# EAGLE design dataloggerver4.1 (EAGLE 9.6.2)
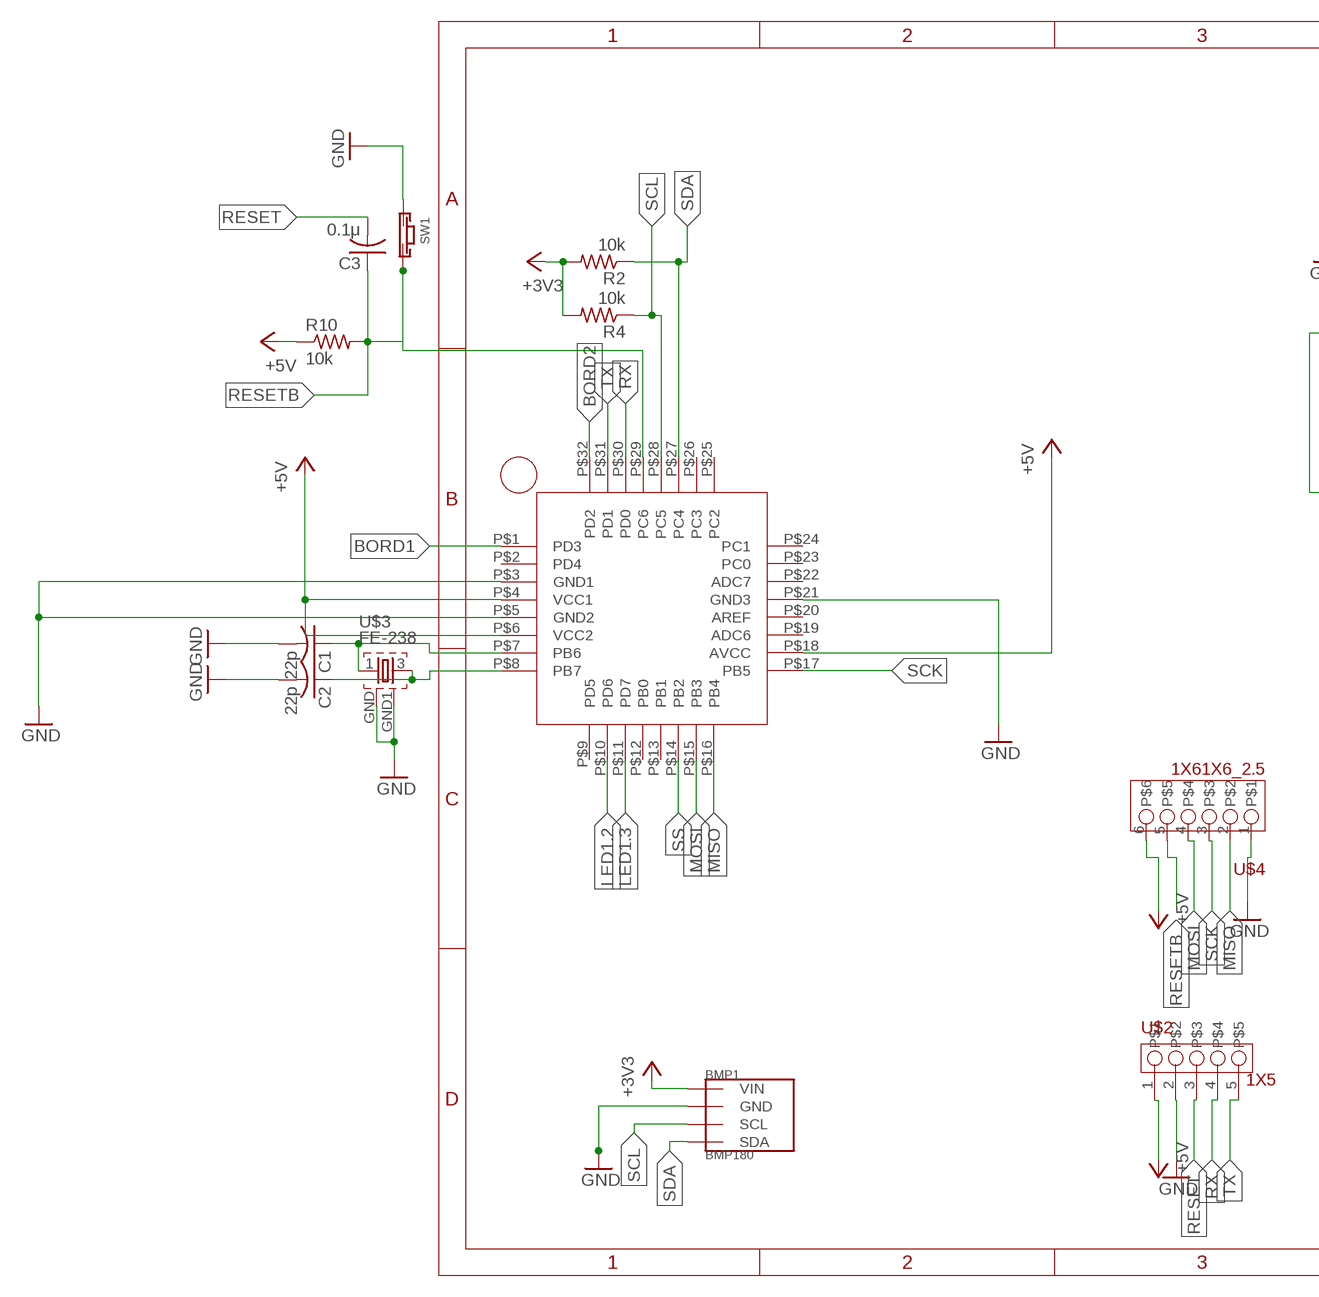
[diagram p0: schematic, sheet 1, part 1 of 2]
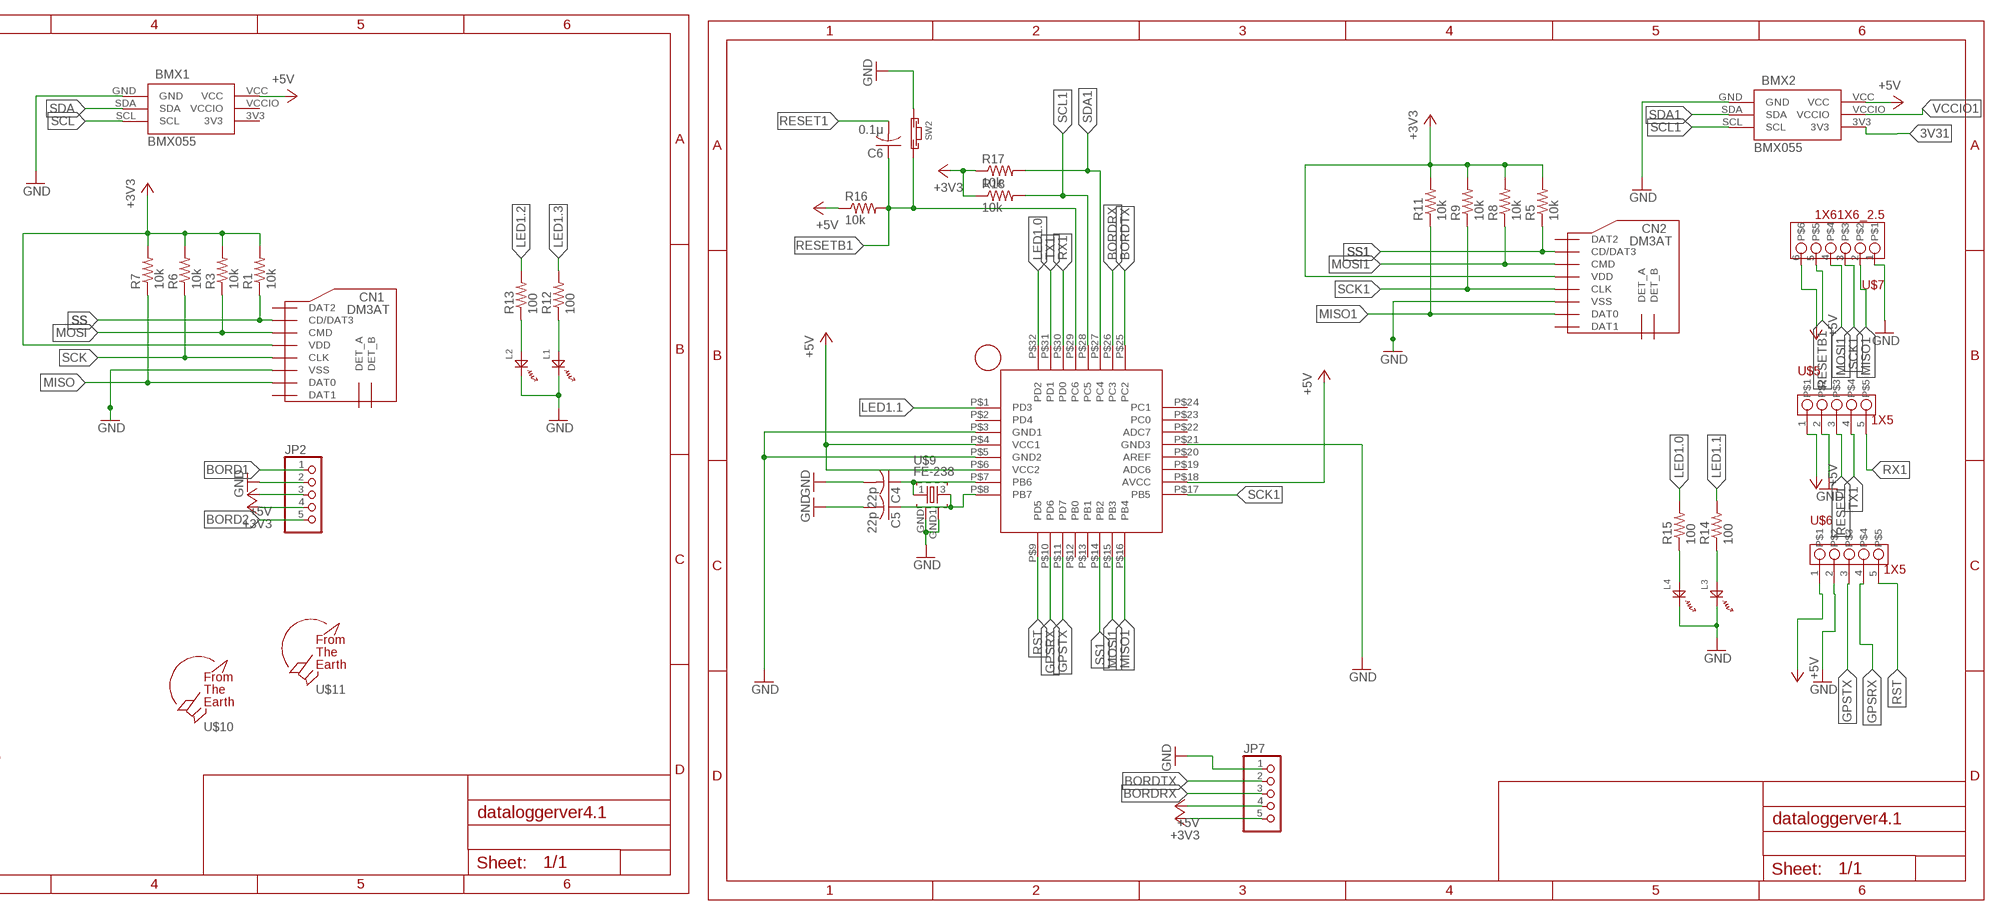
[diagram p1: schematic, sheet 1, part 2 of 2]

## Parts
BMP1  BMP180  [GY-68]
BMX1  BMX055  [BMX055]
BMX2  BMX055  [BMX055]
C1  22p  C-USC1608  [C1608]
C2  22p  C-USC1608  [C1608]
C3  0.1μ  C-USC1608  [C1608]
C4  22p  C-USC1608  [C1608]
C5  22p  C-USC1608  [C1608]
C6  0.1μ  C-USC1608  [C1608]
CN1  DM3AT  [DM3AT]
CN2  DM3AT  [DM3AT]
JP2  PINHD-1X5  [1X05]
JP7  PINHD-1X5  [1X05]
L1  OSXX1608C1A  [OSXX1608C1A]
L2  OSXX1608C1A  [OSXX1608C1A]
L3  OSXX1608C1A  [OSXX1608C1A]
L4  OSXX1608C1A  [OSXX1608C1A]
R1  10k  R-US_R0603  [R0603]
R2  10k  R-US_R0603  [R0603]
R3  10k  R-US_R0603  [R0603]
R4  10k  R-US_R0603  [R0603]
R5  10k  R-US_R0603  [R0603]
R6  10k  R-US_R0603  [R0603]
R7  10k  R-US_R0603  [R0603]
R8  10k  R-US_R0603  [R0603]
R9  10k  R-US_R0603  [R0603]
R10  10k  R-US_R0603  [R0603]
R11  10k  R-US_R0603  [R0603]
R12  100  R-US_R0603  [R0603]
R13  100  R-US_R0603  [R0603]
R14  100  R-US_R0603  [R0603]
R15  100  R-US_R0603  [R0603]
R16  10k  R-US_R0603  [R0603]
R17  10k  R-US_R0603  [R0603]
R18  10k  R-US_R0603  [R0603]
SW1  TVAF06-A020B-R  [TVAF06-A020B-R]
SW2  TVAF06-A020B-R  [TVAF06-A020B-R]
U$1  ATMEGA328P-AUATMEGA328P-AU  [ATMEGA328P-AU]
U$2  1X5  [HDRVR5W64P254_1X5_1310X250X865B]
U$3  FE-238  [OSCCC300X230X120N]
U$4  1X61X6_2.5  [HDRVR6W64P254_1X6_1564X250X865B]
U$5  1X5  [HDRVR5W64P254_1X5_1310X250X865B]
U$6  1X5  [HDRVR5W64P254_1X5_1310X250X865B]
U$7  1X61X6_2.5  [HDRVR6W64P254_1X6_1564X250X865B]
U$8  ATMEGA328P-AUATMEGA328P-AU  [ATMEGA328P-AU]
U$9  FE-238  [OSCCC300X230X120N]
U$10  F.T.E.LOGO  [LOGO]
U$11  F.T.E.LOGO  [LOGO]

## Nets
3V31: BMX2.3V3
+3V3: BMP1.P1(VIN) CN1.VDD CN2.VDD JP2.4 JP7.5 R1.2 R2.2 R3.2 R4.2 R5.2 R6.2 R7.2 R8.2 R9.2 R11.2 R17.1 R18.1
+5V: BMX1.VCC BMX2.VCC JP2.3 JP7.4 R10.1 R16.1 U$1.P$4(VCC1) U$1.P$6(VCC2) U$1.P$18(AVCC) U$2.1 U$4.6 U$5.1 U$6.1 U$7.6 U$8.P$4(VCC1) U$8.P$6(VCC2) U$8.P$18(AVCC)
BORD1: JP2.1 U$8.P$1(PD3)
BORD2: JP2.5 U$8.P$32(PD2)
BORDRX: JP7.3 U$1.P$26(PC3)
BORDTX: JP7.2 U$1.P$25(PC2)
GND: BMP1.P2(GND) BMX1.GND BMX2.GND C1.2 C2.2 C4.2 C5.2 CN1.VSS CN2.VSS JP2.2 JP7.1 L1.CT L2.CT L3.CT L4.CT SW1.P$1 SW2.P$1 U$1.P$3(GND1) U$1.P$5(GND2) U$1.P$21(GND3) U$2.2 U$3.GND U$3.GND1 U$4.1 U$5.2 U$6.2 U$7.1 U$8.P$3(GND1) U$8.P$5(GND2) U$8.P$21(GND3) U$9.GND U$9.GND1
GPSRX: U$1.P$10(PD6) U$6.4
GPSTX: U$1.P$11(PD7) U$6.3
LED1.0: R15.2 U$1.P$32(PD2)
LED1.1: R14.2 U$1.P$1(PD3)
LED1.2: R13.2 U$8.P$10(PD6)
LED1.3: R12.2 U$8.P$11(PD7)
MISO: CN1.DAT0 R7.1 U$4.2 U$8.P$16(PB4)
MISO1: CN2.DAT0 R11.1 U$1.P$16(PB4) U$7.2
MOSI: CN1.CMD R3.1 U$4.4 U$8.P$15(PB3)
MOSI1: CN2.CMD R8.1 U$1.P$15(PB3) U$7.4
N$1: L2.AN R13.1
N$2: L4.AN R15.1
N$3: C4.1 U$1.P$7(PB6) U$9.1
N$7: L1.AN R12.1
N$11: L3.AN R14.1
N$14: C5.1 U$1.P$8(PB7) U$9.3
N$16: C1.1 U$3.1 U$8.P$7(PB6)
N$17: C2.1 U$3.3 U$8.P$8(PB7)
RESET: C3.2 U$2.3
RESET1: C6.2 U$5.3
RESETB: C3.1 R10.2 SW1.P$2 U$4.5 U$8.P$29(PC6)
RESETB1: C6.1 R16.2 SW2.P$2 U$1.P$29(PC6) U$7.5
RST: U$1.P$9(PD5) U$6.5
RX: U$2.4 U$8.P$30(PD0)
RX1: U$1.P$30(PD0) U$5.5
SCK: CN1.CLK R6.1 U$4.3 U$8.P$17(PB5)
SCK1: CN2.CLK R9.1 U$1.P$17(PB5) U$7.3
SCL: BMP1.P3(SCL) BMX1.SCL R4.1 U$8.P$28(PC5)
SCL1: BMX2.SCL R18.2 U$1.P$28(PC5)
SDA: BMP1.P4(SDA) BMX1.SDA R2.1 U$8.P$27(PC4)
SDA1: BMX2.SDA R17.2 U$1.P$27(PC4)
SS: CN1.CD/DAT3 R1.1 U$8.P$14(PB2)
SS1: CN2.CD/DAT3 R5.1 U$1.P$14(PB2)
TX: U$2.5 U$8.P$31(PD1)
TX1: U$1.P$31(PD1) U$5.4
VCCIO1: BMX2.VCCIO
Unconnected: CN1.DAT1 CN1.DAT2 CN1.DET_A CN1.DET_B CN2.DAT1 CN2.DAT2 CN2.DET_A CN2.DET_B U$1.P$2(PD4) U$1.P$12(PB0) U$1.P$13(PB1) U$1.P$19(ADC6) U$1.P$20(AREF) U$1.P$22(ADC7) U$1.P$23(PC0) U$1.P$24(PC1) U$8.P$2(PD4) U$8.P$9(PD5) U$8.P$12(PB0) U$8.P$13(PB1) U$8.P$19(ADC6) U$8.P$20(AREF) U$8.P$22(ADC7) U$8.P$23(PC0) U$8.P$24(PC1) U$8.P$25(PC2) U$8.P$26(PC3)

## Power pins joined to a net without a drawn wire
3V3: BMX1.3V3
VCCIO: BMX1.VCCIO

## Library data of the parts
BMP1 = BMP180:BMP180
BMX1 BMX2 = BMX055:BMX055
C1-C6 = rcl:C-US: CAPACITOR, American symbol; SPICEPREFIX: C
CN1 CN2 = microSD:DM3AT
JP2 JP7 = pinhead:PINHD-1X5: PIN HEADER
L1-L4 = Chip LED:OSXX1608C1A
R1-R18 = rcl:R-US_: RESISTOR, American symbol; SPICEPREFIX: R
SW1 SW2 = Tact switch:TVAF06-A020B-R
U$1 U$8 = ATMEGA328P-AU:ATMEGA328P-AU
U$2 U$5 U$6 = pin_socket:1X5
U$3 U$9 = FA-238:FE-238
U$4 U$7 = pin_socket:1X6
U$10 U$11 = logo:F.T.E.LOGO

## Board
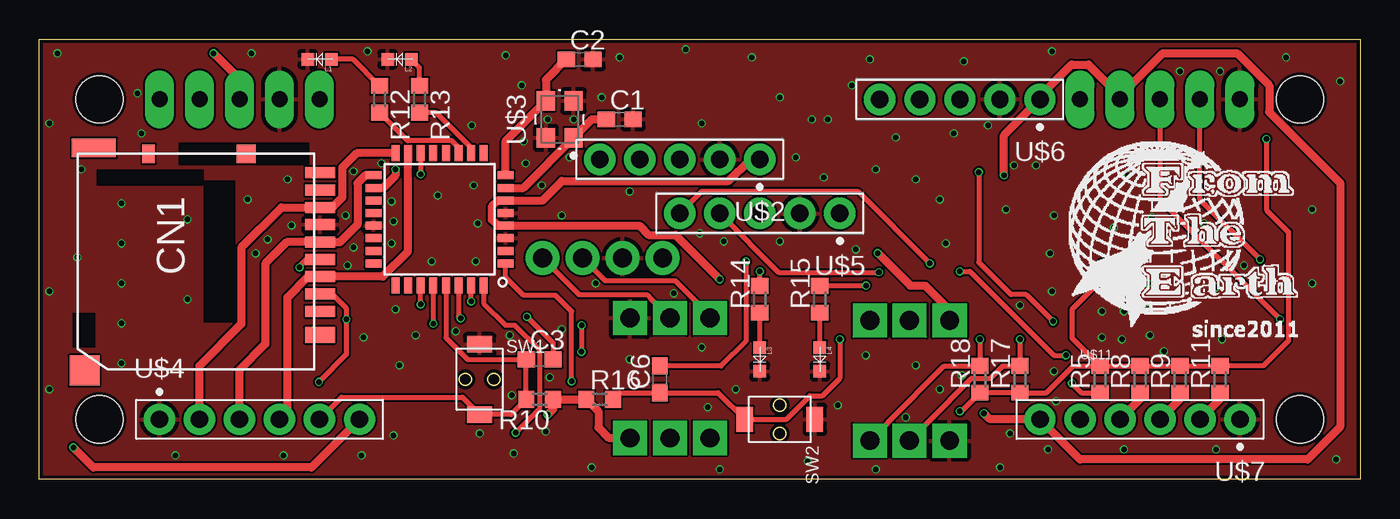
[diagram p2: board, top side]
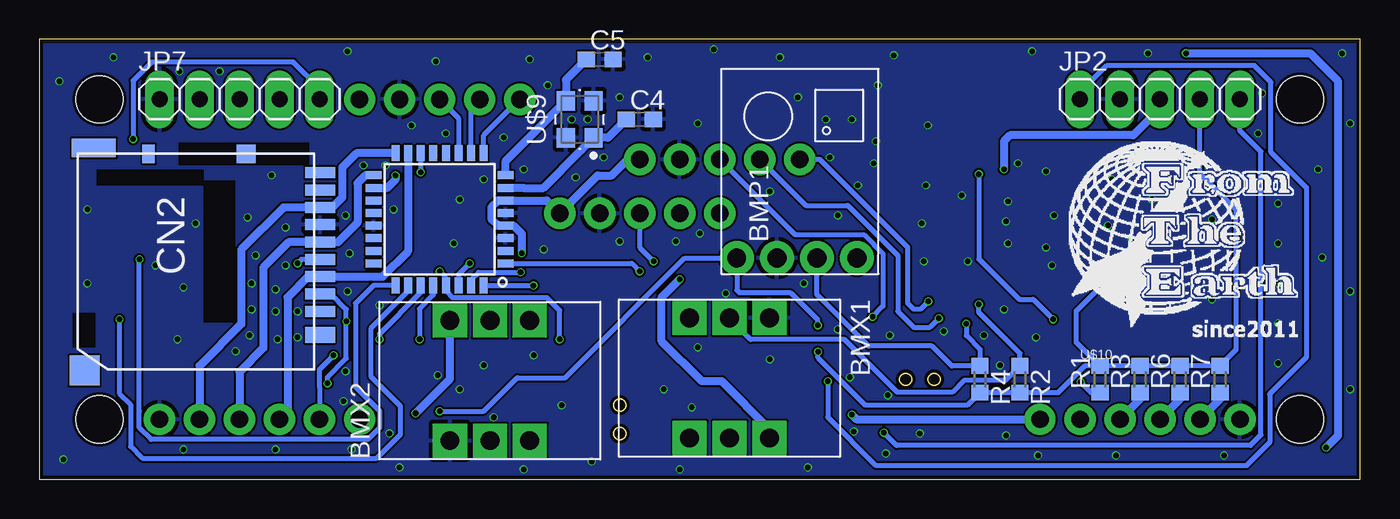
[diagram p3: board, bottom side, seen from below]

Size 83.82 x 27.94 mm. Coordinates in mm from the lower left corner, seen from the top.
Outline: 0,0 0,27.94 83.82,27.94 83.82,0 0,0
Copper layers (1*16): Top 0.035mm / dielectric 1.6mm / Bottom 0.035mm
Design rules "jlcpcb-2layers": minimum track width 5mil, minimum drill 0.3mm, track to track 5mil, track to pad 5mil, pad to pad 5mil, via to via 5mil, smd to smd 5mil, copper to edge 0.2mm, drill to drill 6mil, minimum pad ring 10mil, minimum via ring 3mil, stop-mask expansion 4mil, vias tented up to drill 0mil, thermal gap 10mil
Holes 3 mm at 3.81,24.13 3.81,3.81 80.01,24.13 80.01,3.81

### Footprints (pad centres in the part's own frame; a part is rotated, then mirrored left to right if it is on the bottom)
GY-68 = drill 1.2: P1 -5,4; P2 -5,1.46; P3 -5,-1.08; P4 -5,-3.62
BMX055 = drill 1.2 pad 1.5 square: 3V3 8.81,-9.53; GND 1.19,-4.46; SCL 1.19,-9.53; SDA 1.19,-7; VCC 8.81,-4.46; VCCIO 8.81,-7
C1608 = smd 1.1 x 1: 1 -0.85,0; 2 0.85,0
DM3AT = smd 0.7 x 1.9: CD/DAT3 2.2,6.4; CLK -1.1,6.4; CMD 1.1,6.4; DAT0 -3.3,6.4; DAT1 -4.4,6.4; DAT2 3.3,6.4; DET_B -5.5,6.4; VDD 0,6.4; VSS -2.2,6.4 | smd 1.2 x 0.8: DET_A -6.7,-4.5 | smd 1 x 1.9: P$9 4.8,6.381 | smd 1.2 x 1.2: P$11 -6.7,1.7 | smd 1.2 x 2.8: P$13 -7.081,-7.973 | smd 1.9 x 1.9: P$14 7.054,-8.562
1X05 = drill 1.016 long: 1 -5.08,0; 2 -2.54,0; 3 0,0; 4 2.54,0; 5 5.08,0
OSXX1608C1A = smd 0.8 x 0.8: AN -0.75,0; CT 0.75,0
R0603 = smd 1 x 1.1: 1 -0.85,0; 2 0.85,0
TVAF06-A020B-R = smd 1.6 x 1.05: P$1 0,2.225; P$2 0,-2.225
ATMEGA328P-AU = smd 1.016 x 0.508: P$1 -4.2,2.8; P$2 -4.2,2; P$3 -4.2,1.2; P$4 -4.2,0.4; P$5 -4.2,-0.4; P$6 -4.2,-1.2; P$7 -4.2,-2; P$8 -4.2,-2.8; P$17 4.2,-2.8; P$18 4.2,-2; P$19 4.2,-1.2; P$20 4.2,-0.4; P$21 4.2,0.4; P$22 4.2,1.2; P$23 4.2,2; P$24 4.2,2.8 | smd 0.508 x 1.016: P$9 -2.8,-4.2; P$10 -2,-4.2; P$11 -1.2,-4.2; P$12 -0.4,-4.2; P$13 0.4,-4.2; P$14 1.2,-4.2; P$15 2,-4.2; P$16 2.8,-4.2; P$25 2.8,4.2; P$26 2,4.2; P$27 1.2,4.2; P$28 0.4,4.2; P$29 -0.4,4.2; P$30 -1.2,4.2; P$31 -2,4.2; P$32 -2.8,4.2
HDRVR5W64P254_1X5_1310X250X865B = drill 1.105 pad 1.705: 1 0,0; 2 2.54,0; 3 5.08,0; 4 7.62,0; 5 10.16,0
OSCCC300X230X120N = smd 1.262 x 1.162: 1 -1.175,-0.875; 3 1.175,0.875; GND 1.175,-0.875; GND1 -1.175,0.875
HDRVR6W64P254_1X6_1564X250X865B = drill 1.105 pad 1.705: 1 0,0; 2 2.54,0; 3 5.08,0; 4 7.62,0; 5 10.16,0; 6 12.7,0

### Placement (x,y rotation side)
BMP1  35.56,19.05 90 bottom
BMX1  33.02,11.43 270 bottom
BMX2  62.23,1.27 90 bottom
C1  36.83,22.86 0 top
C2  34.29,26.67 0 top
C3  31.75,7.62 0 top
C4  45.72,22.86 0 bottom
C5  48.26,26.67 0 bottom
C6  39.37,6.35 90 top
CN1  11.43,13.97 270 top
CN2  72.39,13.97 270 bottom
JP2  12.7,24.13 0 bottom
JP7  71.12,24.13 0 bottom
L1  17.78,26.67 180 top
L2  22.86,26.67 180 top
L3  45.72,7.62 270 top
L4  49.53,7.62 270 top
R1  16.51,6.35 90 bottom
R2  21.59,6.35 270 bottom
R3  13.97,6.35 90 bottom
R4  24.13,6.35 270 bottom
R5  67.31,6.35 90 top
R6  11.43,6.35 90 bottom
R7  8.89,6.35 90 bottom
R8  69.85,6.35 90 top
R9  72.39,6.35 90 top
R10  31.75,5.08 180 top
R11  74.93,6.35 90 top
R12  21.59,24.13 270 top
R13  24.13,24.13 270 top
R14  45.72,11.43 90 top
R15  49.53,11.43 90 top
R16  35.56,5.08 0 top
R17  62.23,6.35 90 top
R18  59.69,6.35 90 top
SW1  27.94,6.35 0 top
SW2  46.99,3.81 270 top
U$1  58.42,16.51 180 bottom
U$2  45.72,20.32 180 top
U$3  33.02,22.86 90 top
U$4  7.62,3.81 0 top
U$5  50.8,16.89 180 top
U$6  63.5,24.13 180 top
U$7  76.2,3.81 180 top
U$8  25.4,16.51 180 top
U$9  49.53,22.86 90 bottom
U$10  19.05,7.62 0 bottom
U$11  64.77,7.62 0 top

### Tracks (layer width: path | path; a pad name or v marks a point on that pad's centre or on a via)
+3V3  (via drill 0.35)
  Top 0.305: R5.2 R8.2 R9.2 R11.2 74.95,7.22 77.69,7.22 79.27,8.8 79.27,15.71 77.87,17.12 v77.87,21.61 | R5.2 65.62,7.2 63.92,5.5 R17.1 R18.1 58.51,4.32 v58.42,4.32 | CN1.VDD 16.94,13.97 16.51,13.54 v16.51,13.46 | R5.2 65.53,8.98 65.53,10.79 67.44,12.7 v67.44,13.72 | v34.42,9.78 34.42,8.12 v34.41,8.11
  Bottom 0.305: R1.2 R3.2 R6.2 R7.2 7.87,8.22 7.87,17.14 10.16,19.43 JP2.4 | R1.2 17.47,7.2 19.17,5.5 R2.2 R4.2 24.93,4.7 31.38,4.7 34.41,7.72 v34.41,8.11 | v58.42,4.32 55.63,4.32 53.49,6.45 50.46,6.45 42.86,14.05 BMP1.P1 39.56,12.02 39.4,11.85 36.16,11.85 34.42,10.11 v34.42,9.78 | v16.51,13.46 16.51,12.19 18.03,10.67 18.03,8.72 R1.2 | JP7.5 66.04,24.83 67.7,26.49 76.69,26.49 77.87,25.32 v77.87,21.61 | CN2.VDD 67.18,13.97 v67.44,13.72
+5V  (via drill 0.35)
  Top 0.508: v22.61,19.68 22.61,19.3 21.81,18.51 U$8.P$18 | v32.26,4.1 v32.26,4.11 32.6,4.45 R10.1 R16.1 35.47,4.32 35.47,3.3 36.15,2.62 BMX1.VCC | U$2.1 45.12,20.32 43.75,18.94 33.17,18.94 31.93,17.71 U$8.P$6 29.1,17.71 28.71,17.32 28.71,16.5 29.1,16.11 U$8.P$4 38.08,16.11 38.67,15.51 40.37,15.51 v43.18,12.7 | v61.21,19.3 61.21,21.84 U$6.1 63.5,24.34 65.5,26.34 66.58,26.34 68.58,24.34 JP7.4 68.55,24.16 68.55,24.31 71.3,27.05 76.02,27.05 78.06,25.02 78.06,23.32 82.55,18.83 82.55,3.33 80.49,1.27 66.04,1.27 U$7.6 60.33,3.81 v59.94,4.19 | v2.16,2.03 3.43,0.76 17.27,0.76 U$4.6 | v11.05,27.05 12.7,25.4 JP2.3 | v53.2,14.37 55.27,12.3 56.21,12.3 57.77,10.75 BMX2.VCC
  Bottom 0.508: JP2.3 12.7,23.54 14.4,21.84 22.22,21.84 22.61,21.46 v22.61,19.68 | v32.26,4.1 31.97,3.81 U$4.6 | U$2.1 46.48,20.32 47.5,19.3 48.39,19.3 U$5.1 51.62,17.71 U$1.P$6 54.72,17.71 55.11,17.32 55.11,16.5 54.72,16.11 U$1.P$4 53.72,16.11 53.2,15.59 v53.2,14.37 | U$1.P$18 61.74,18.51 61.21,19.03 v61.21,19.3 | v2.16,2.03 1.4,2.79 1.4,25.27 3.17,27.05 v11.05,27.05 | BMX2.VCC 57.77,6.37 v59.94,4.19 | BMX1.VCC 37.48,3.19 40.51,6.22 41.78,6.22 44.32,8.76 44.32,11.56 v43.18,12.7
BORD1  (via drill 0.35)
  Top 0.305: U$8.P$1 29.6,12.82 30.74,11.68 32.77,11.68 33.78,10.67 v33.78,6.22
  Bottom 0.305: JP2.1 17.78,24.57 16.07,26.29 6.73,26.29 5.66,25.22 5.66,20.79 3.4,18.53 3.4,7.75 5.74,5.41 5.74,2.35 7.22,0.87 30.71,0.87 33.78,3.94 v33.78,6.22
BORD2  (via drill 0.35)
  Top 0.305: v30.23,2.96 31.73,4.46 31.73,8.24 30.17,9.8 29.57,9.8 28.2,11.17 U$8.P$32
  Bottom 0.305: v30.23,2.96 29.42,2.16 6.96,2.16 6.3,2.82 6.3,20.82 7.62,22.14 JP2.5
BORDRX  (via drill 0.35)
  Top 0.305: JP7.3 71.12,17.78 v78.74,10.16
  Bottom 0.305: v78.74,10.16 78.74,5.46 78.03,4.75 78.03,2.09 77.29,1.34 62.41,1.34 60.91,2.85 60.91,4.64 62.76,6.5 62.76,9.61 60.42,11.95 U$1.P$26
BORDTX  (via drill 0.35)
  Top 0.305: v77.47,13.97 73.66,17.78 JP7.2
  Bottom 0.305: U$1.P$25 62.62,12.31 63.75,11.18 63.75,5.87 62.23,4.34 62.23,3.28 62.97,2.54 76.73,2.54 77.47,3.28 77.47,4.34 v77.47,13.97
GND  (via drill 0.35)
  other vias: 57.15,17.78 61.34,17.14 64.14,14.35 64.39,16.76 63.25,19.94 61.85,19.94 68.2,16 70.1,14.22 68.2,13.59 68.83,12.06 68.83,10.67 70.36,12.45 70.36,10.79 70.48,9.14 71.37,8.13 68.71,8.89 67.44,9.02 67.44,10.67 64.26,11.94 26.42,9.4 29.84,9.14 22.86,7.24 19.56,13.59 19.94,14.73 22.35,14.99 22.35,17.65 22.48,16.38 24.89,13.84 25.27,18.03 27.56,18.67 27.81,16.26 27.69,13.84 19.43,16.76 16,16.13 14.48,15.24 13.72,14.35 19.94,19.56 21.72,20.07 5.21,17.53 5.21,14.99 5.21,12.45 5.21,9.91 5.21,7.37 9.4,16.51 9.4,11.43 13.21,17.78 15.75,19.05 1.14,27.05 13.46,27.05 2.67,19.68 2.41,14.1 0.64,5.71 0.64,11.94 0.64,22.61 22.48,2.79 27.94,2.92 20.57,9.02 22.61,10.79 23.88,9.14 33.15,16.76 27.43,22.48 36.83,26.8 29.59,26.92 41.02,27.3 45.21,26.8 58.67,26.54 49.02,22.86 49.78,19.18 50.67,4.7 42.42,4.57 44.2,5.71 48.77,1.14 43.18,0.64 35.05,0.76 79.12,26.8 82.55,25.27 80.77,17.14 80.77,12.45 75.06,8.89 74.68,12.19 76.45,13.59 73.91,16.26 70.61,16.64 69.09,19.3 82.3,1.27 60.96,0.76 53.09,0.64 55.63,7.24 52.45,7.87 32.13,3.05 20.45,1.52 8.64,1.52 15.49,1.52 29.97,5.33 32.38,6.48 60.2,22.48 64.26,27.18 72.39,25.91 58.04,21.97 62.23,11.05 61.6,2.92 64.01,1.91 68.83,1.91 74.68,1.91 64.52,4.95 64.39,6.86 54.99,3.94 57.15,5.71 58.55,6.6 35.31,12.45 40.26,11.81 33.15,9.53 42.04,8.38 37.47,7.62 32.26,22.86 33.91,22.86 50.04,22.86 20.83,27.18 30.73,21.46 30.86,20.07 53.09,19.68 52.71,26.67 54.36,21.72 30.61,25.02 48.01,20.45 51.56,25.02 42.04,22.61 46.99,24.26 35.69,24.26 74.93,25.91 6.22,24.51 6.48,21.97 33.66,20.45 31.88,18.67 37.47,18.29 55.63,19.05 57.53,14.99 46.99,15.11 51.82,14.61 43.43,15.11 41.91,15.62 30.1,1.65
  pour Top: -50.8,-43.18 -83.82,-10.16 -83.82,57.15 -53.34,87.63 77.47,87.63 106.68,58.42 106.68,-11.43 74.93,-43.18 -49.53,-43.18
  pour Bottom: -50.8,-43.18 -83.82,-10.16 -83.82,57.15 -53.34,87.63 77.47,87.63 106.68,58.42 106.68,-8.89 106.68,-11.43 80.01,-38.1 74.93,-43.18 -49.53,-43.18
GPSRX
  Bottom 0.305: U$1.P$10 56.42,24.13 U$6.4
GPSTX
  Bottom 0.305: U$6.3 57.22,22.93 U$1.P$11
LED1.0  (via drill 0.35)
  Top 0.305: R15.2 49.56,12.31 v52.46,12.31
  Bottom 0.305: U$1.P$32 v52.46,12.31
LED1.1  (via drill 0.35)
  Top 0.305: R14.2 v45.72,13.21
  Bottom 0.305: v45.72,13.21 46.22,13.71 U$1.P$1
LED1.2
  Top 0.305: U$8.P$10 27.4,21.07 25.19,23.28 R13.2
LED1.3
  Top 0.305: R12.2 23.37,21.5 26.17,21.5 26.6,21.07 U$8.P$11
MISO
  Top 0.508: U$8.P$16 20.14,20.71 19.23,19.8 19.23,17.91 18.59,17.27 CN1.DAT0 15.37,17.27 12.81,14.72 12.81,9.87 10.16,7.21 U$4.2
  Bottom 0.508: U$4.2 8.89,5.08 R7.1
MISO1
  Top 0.508: U$7.2 74.93,5.08 R11.1
  Bottom 0.508: U$1.P$16 63.69,20.71 64.59,19.81 64.59,17.91 65.23,17.27 CN2.DAT0 68.33,17.27 71.01,14.59 71.01,9.87 73.66,7.21 U$7.2
MOSI
  Top 0.508: U$8.P$15 23.4,14.48 21.79,12.87 CN1.CMD 17.06,12.87 15.75,11.56 15.75,4.32 U$4.4
  Bottom 0.508: U$4.4 13.97,5.08 R3.1
MOSI1
  Top 0.508: U$7.4 69.85,5.08 R8.1
  Bottom 0.508: U$1.P$15 60.42,14.48 62.03,12.87 CN2.CMD 66.76,12.87 68.07,11.56 68.07,4.32 U$7.4
N$1
  Top 0.305: R13.1 24.13,26.15 L2.AN
N$2
  Top 0.305: L4.AN R15.1
N$3
  Bottom 0.508: U$1.P$7 53.34,18.51 53.1,18.51 51.83,18.51 49.44,20.9 U$9.1 47.75,21.68 C4.1
N$7
  Top 0.305: R12.1 19.9,26.67 L1.AN
N$11
  Top 0.305: L3.AN R14.1
N$14
  Bottom 0.508: U$1.P$8 54.22,20.22 U$9.3 50.41,25.38 C5.1
N$16
  Top 0.508: U$8.P$7 30.72,18.51 U$3.1 35.07,22.86 C1.1
N$17
  Top 0.508: U$8.P$8 29.6,21.49 U$3.3 32.15,25.38 C2.1
RESET  (via drill 0.35)
  Top 0.305: v30.95,10.33 32.6,8.68 C3.2
  Bottom 0.305: U$2.3 35.86,15.54 31.5,15.54 30.28,14.31 30.28,11 v30.95,10.33
RESET1  (via drill 0.35)
  Top 0.305: v44.83,13.84 44.83,8.76 43.27,7.2 C6.2
  Bottom 0.305: U$5.3 45.72,14.73 v44.83,13.84
RESETB
  Top 0.305: U$8.P$29 25.8,8.99 27.18,7.62 C3.1 R10.2 29.95,4.12 SW1.P$2 26.86,5.21 19.18,5.21 U$4.5
RESETB1  (via drill 0.35)
  Top 0.305: v50.8,8.89 50.8,6.41 49.69,5.3 48.9,5.3 47.4,3.81 SW2.P$2 43.08,5.5 C6.1 36.83,5.5 R16.2 | v58.42,13.21 59.05,13.21 64.39,7.87 v65.15,7.87
  Bottom 0.305: v50.8,8.89 50.8,10.73 51.59,11.52 57.59,11.52 58.02,11.95 U$1.P$29 58.02,12.81 v58.42,13.21 | U$7.5 66.04,5.85 66.06,5.88 66.06,6.96 v65.15,7.87
RST
  Bottom 0.305: U$1.P$9 55.62,21.85 U$6.5
RX  (via drill 0.35)
  Top 0.305: U$8.P$30 26.6,10.36 v26.73,10.22
  Bottom 0.305: U$2.4 35.18,17.4 32.51,17.4 29.34,14.22 29.34,10.67 28.32,9.65 27.3,9.65 v26.73,10.22
RX1  (via drill 0.35)
  Top 0.305: v56.52,13.72 51.94,18.29 42.04,18.29 U$5.5
  Bottom 0.305: v56.52,13.72 57.22,13.01 U$1.P$30
SCK
  Top 0.508: U$8.P$17 20.69,19.31 20.18,18.8 20.18,16.18 19.08,15.07 CN1.CLK 15.71,15.07 14.33,13.7 14.33,8.59 12.7,6.95 U$4.3
  Bottom 0.508: U$4.3 11.43,5.08 R6.1
SCK1
  Top 0.508: U$7.3 72.39,5.08 R9.1
  Bottom 0.508: U$1.P$17 63.13,19.31 63.64,18.8 63.64,16.3 64.87,15.07 CN2.CLK 67.99,15.07 69.61,13.45 69.61,8.33 71.12,6.82 U$7.3
SCL  (via drill 0.35)
  Top 0.305: BMP1.P3 35.92,12.62 40.33,12.62 42.55,10.39 BMX1.SCL | U$8.P$28 v25,9.89
  Bottom 0.305: BMP1.P3 34.48,11.75 31.19,8.46 27.17,8.46 25.91,7.2 R4.1 24.13,8.26 25,9.12 v25,9.89
SCL1  (via drill 0.35)
  Top 0.305: v59.69,8.89 R18.2 57.42,7.2 53.87,3.66 53.87,3.63 BMX2.SCL
  Bottom 0.305: U$1.P$28 58.82,11.7 59.69,10.83 v59.69,8.89
SDA  (via drill 0.35)
  Top 0.305: BMP1.P4 34.26,11.73 38.55,11.73 38.84,11.44 38.84,11.42 BMX1.SDA | v24.2,11.12 U$8.P$27
  Bottom 0.305: BMX1.SDA 38.84,9.06 38.84,9.04 38.68,8.88 32.72,8.88 29.37,5.53 25.88,5.53 25.1,6.31 22.48,6.31 R2.1 21.59,8 24.2,10.61 v24.2,11.12
SDA1  (via drill 0.35)
  Top 0.305: v62.23,8.89 R17.2 61.14,7.2 60.36,6.42 59.17,6.42 56.41,3.67 56.41,3.64 BMX2.SDA
  Bottom 0.305: U$1.P$27 59.62,11.86 62.23,9.24 v62.23,8.89
SS  (via drill 0.35)
  Top 0.305: CN1.CD/DAT3 18.59,11.77 19.48,10.88 v19.48,10.16 19.48,7.92 v17.74,6.18 | U$8.P$14 v24.2,19.37
  Bottom 0.305: R1.1 17.06,5.5 v17.74,6.18 | v24.2,19.37 24.2,13.99 21.64,11.43 20.75,11.43 v19.48,10.16
SS1  (via drill 0.35)
  Top 0.305: v65.53,6.1 66.13,5.5 R5.1 | v59.62,19.5 59.62,13.79 61.67,11.73 62.64,11.73 v64.34,10.03
  Bottom 0.305: CN2.CD/DAT3 65.32,11.77 64.34,10.79 v64.34,10.03 64.34,7.67 65.53,6.48 v65.53,6.1 | U$1.P$14 v59.62,19.5
TX  (via drill 0.35)
  Top 0.305: v27.4,11.3 U$8.P$31
  Bottom 0.305: v27.4,11.3 27.91,10.79 28.32,10.79 28.7,11.18 28.7,14.73 34.29,20.32 U$2.5
TX1  (via drill 0.35)
  Top 0.305: U$5.4 46.92,13.15 v53.28,13.15
  Bottom 0.305: v53.28,13.15 55.95,13.15 56.42,12.68 U$1.P$31